# Altium schematic sheet bt_current_monitor.SchDoc
size A4
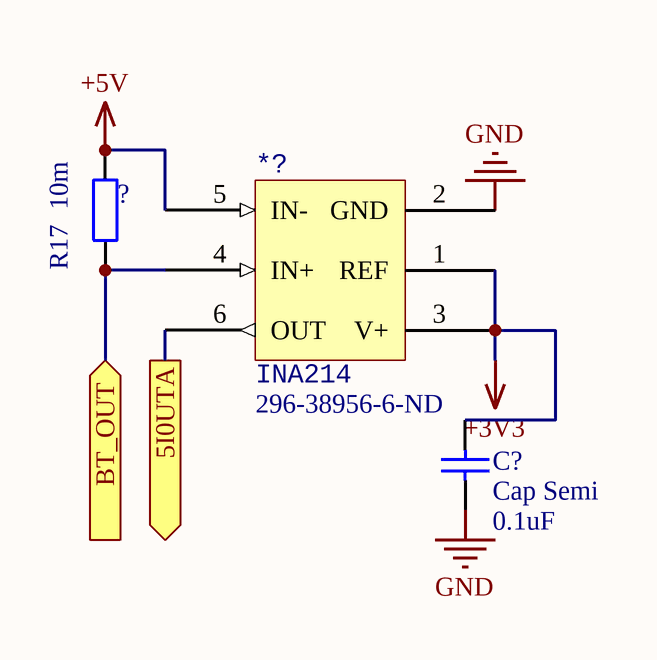
[diagram p0: bt_current_monitor.SchDoc]

## Parts
*?  INA214  Supplier Part Number 1: 296-38956-6-ND  [SOT65P210X110-6N]
?  R17  value 10m  [1608[0603]]
C?  Cap Semi  value 0.1uF  [1608[0603]]

## Ports
5I0UTA (out), BT_OUT (in)

## Nets
+3V3: *?.1(REF) *?.3(V+) C?.2
+5V: *?.5(IN-) ?.2
GND: *?.2(GND) C?.1
5I0UTA: *?.6(OUT) ; port 5I0UTA
BT_OUT: *?.4(IN+) ?.1 ; port BT_OUT

## Library data of the parts
*? = INA214: Current monitor; Supplier 1: Digi-Key
? = Res2: Resistor; Published: 8-Jun-2000; LatestRevisionDate: 17-Jul-2002; LatestRevisionNote: Re-released for DXP Platform.; PackageReference: AXIAL-0.4; Publisher: Altium Limited; PackageDescription: Axial Device, Thru-Hole; 2 Leads; 0.4 in Pin Spacing
C? = Cap Semi: Capacitor (Semiconductor SIM Model); Published: 8-Jun-2000; LatestRevisionDate: 29-May-2009; LatestRevisionNote: IPC-7351 Footprint Added.; PackageReference: C1206; Publisher: Altium Limited; PackageDescription: Chip Capacitor